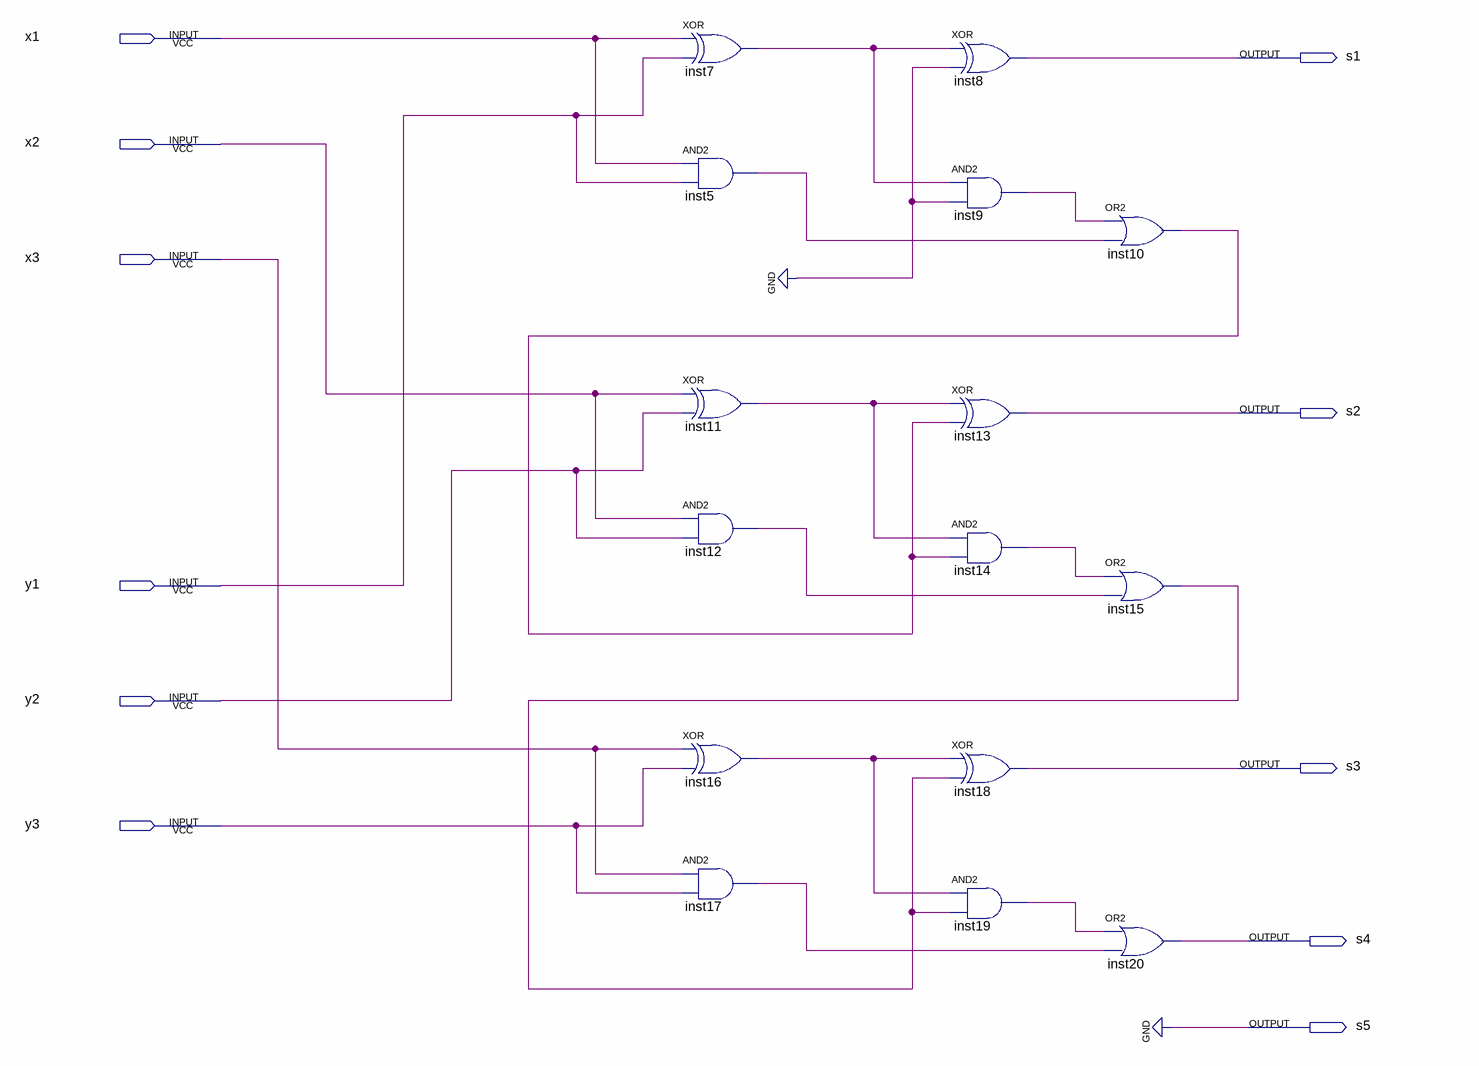
[diagram p0: schematic sheet]
// Quartus schematic adder_6x5.bdf as structural Verilog: 15 symbols, 11 pins
module adder_6x5 (
  input  x1,
  input  x2,
  input  x3,
  input  y1,
  input  y2,
  input  y3,
  output s1,
  output s2,
  output s3,
  output s4,
  output s5
);

  wire inst5_out, inst7_out, inst9_out, inst10_out, inst11_out, inst12_out, inst14_out, inst15_out,
       inst16_out, inst17_out, inst19_out;

  xor inst7 (inst7_out, x1, y1);
  and inst5 (inst5_out, x1, y1);
  xor inst11 (inst11_out, x2, y2);
  and inst12 (inst12_out, x2, y2);
  xor inst16 (inst16_out, x3, y3);
  and inst17 (inst17_out, x3, y3);
  xor inst8 (s1, inst7_out, 1'b0);
  and inst9 (inst9_out, inst7_out, 1'b0);
  xor inst13 (s2, inst11_out, inst10_out);
  and inst14 (inst14_out, inst11_out, inst10_out);
  xor inst18 (s3, inst16_out, inst15_out);
  and inst19 (inst19_out, inst16_out, inst15_out);
  or inst10 (inst10_out, inst9_out, inst5_out);
  or inst15 (inst15_out, inst14_out, inst12_out);
  or inst20 (s4, inst19_out, inst17_out);

  assign s5 = 1'b0;
endmodule
